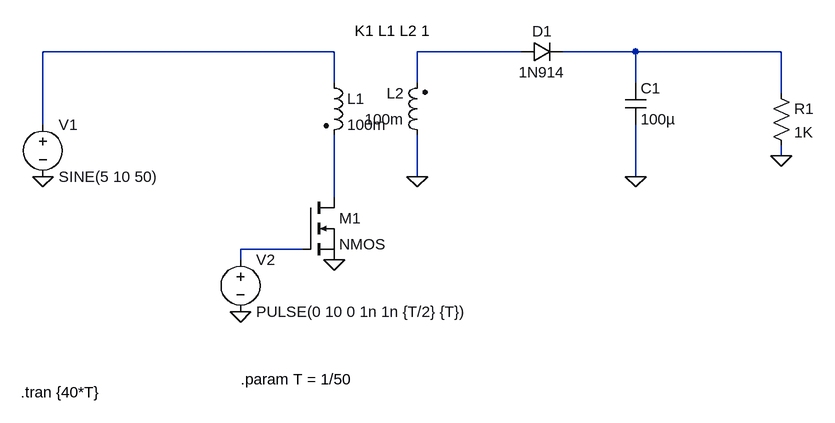
[diagram p0: schematic Draft1.asc]
Draft1.asc, the LTspice schematic file:
Version 4
SHEET 1 1224 680
WIRE 480 -16 32 -16
WIRE 768 -16 608 -16
WIRE 944 -16 832 -16
WIRE 1168 -16 944 -16
WIRE 480 32 480 -16
WIRE 608 32 608 -16
WIRE 944 32 944 -16
WIRE 1168 48 1168 -16
WIRE 32 96 32 -16
WIRE 1168 144 1168 128
WIRE 608 176 608 112
WIRE 944 176 944 96
WIRE 480 208 480 112
WIRE 432 288 336 288
WIRE 336 304 336 288
FLAG 32 176 0
FLAG 336 384 0
FLAG 944 176 0
FLAG 1168 144 0
FLAG 480 304 0
FLAG 608 176 0
SYMBOL voltage 32 80 R0
WINDOW 123 0 0 Left 0
WINDOW 39 0 0 Left 0
SYMATTR InstName V1
SYMATTR Value SINE(5 10 50)
SYMBOL nmos 432 208 R0
SYMATTR InstName M1
SYMBOL voltage 336 288 R0
WINDOW 123 0 0 Left 0
WINDOW 39 0 0 Left 0
SYMATTR InstName V2
SYMATTR Value PULSE(0 10 0 1n 1n {T/2} {T})
SYMBOL ind2 464 16 R0
SYMATTR InstName L1
SYMATTR Value 100m
SYMATTR Type ind
SYMBOL ind2 624 128 R180
WINDOW 0 36 80 Left 2
WINDOW 3 36 40 Left 2
SYMATTR InstName L2
SYMATTR Value 100m
SYMATTR Type ind
SYMBOL diode 768 0 R270
WINDOW 0 32 32 VTop 2
WINDOW 3 0 32 VBottom 2
SYMATTR InstName D1
SYMATTR Value 1N914
SYMBOL cap 928 32 R0
SYMATTR InstName C1
SYMATTR Value 100µ
SYMBOL res 1152 32 R0
SYMATTR InstName R1
SYMATTR Value 1K
TEXT 512 -48 Left 2 !K1 L1 L2 1
TEXT 336 488 Left 2 !.param T = 1/50
TEXT -2 508 Left 2 !.tran {40*T}

The netlist it stands for:
* Draft1.asc
V1 N001 0 SINE(5 10 50)
M1 N004 N005 0 0 NMOS
V2 N005 0 PULSE(0 10 0 1n 1n {T/2} {T})
L1 N001 N004 100m
L2 0 N002 100m
D1 N002 N003 1N914
C1 N003 0 100µ
R1 N003 0 1K
.model D D
.lib standard.dio
.model NMOS NMOS
.model PMOS PMOS
.lib standard.mos
K1 L1 L2 1
.param T = 1/50
.tran {40*T}
.backanno
.end